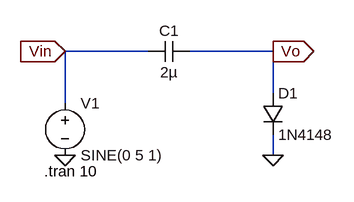
[diagram p0: schematic Diode_Clamping.asc]
Diode_Clamping.asc, the LTspice schematic file:
Version 4
SHEET 1 880 680
WIRE 272 128 144 128
WIRE 464 128 336 128
WIRE 464 192 464 128
WIRE 144 208 144 128
WIRE 464 288 464 256
FLAG 144 288 0
FLAG 464 288 0
FLAG 464 128 Vo
IOPIN 464 128 Out
FLAG 144 128 Vin
IOPIN 144 128 In
SYMBOL diode 448 192 R0
SYMATTR InstName D1
SYMATTR Value 1N4148
SYMBOL cap 336 112 R90
WINDOW 0 0 32 VBottom 2
WINDOW 3 32 32 VTop 2
SYMATTR InstName C1
SYMATTR Value 2µ
SYMBOL voltage 144 192 R0
SYMATTR InstName V1
SYMATTR Value SINE(0 5 1)
TEXT 112 312 Left 2 !.tran 10

The netlist it stands for:
* Diode_Clamping.asc
D1 Vo 0 1N4148
C1 Vo Vin 2µ
V1 Vin 0 SINE(0 5 1)
.model D D
.lib standard.dio
.tran 10
.backanno
.end

* Results of the author's LTspice run, read from the files saved beside the schematic
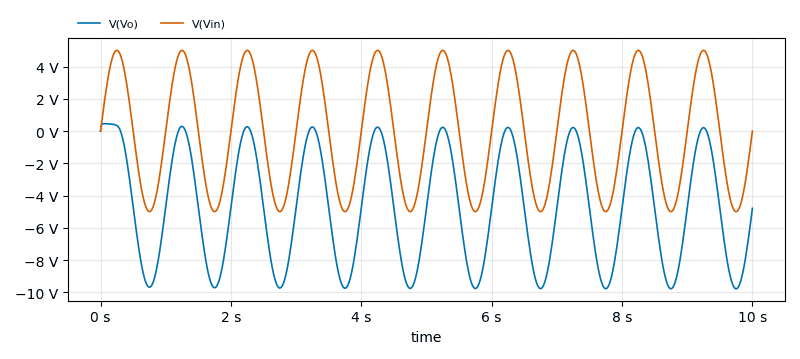
[diagram p1: Transient Analysis of Diode_Clamping.asc, plotted from the saved traces]
* Transient Analysis, 1 run:
*   V(Vo): min -9.777 V, max 458.3 mV, average -4.703 V, rms 5.913 V, last -4.787 V
*   V(Vin): min -5 V, max 5 V, average 1.188 mV, rms 3.537 V, last 0 V